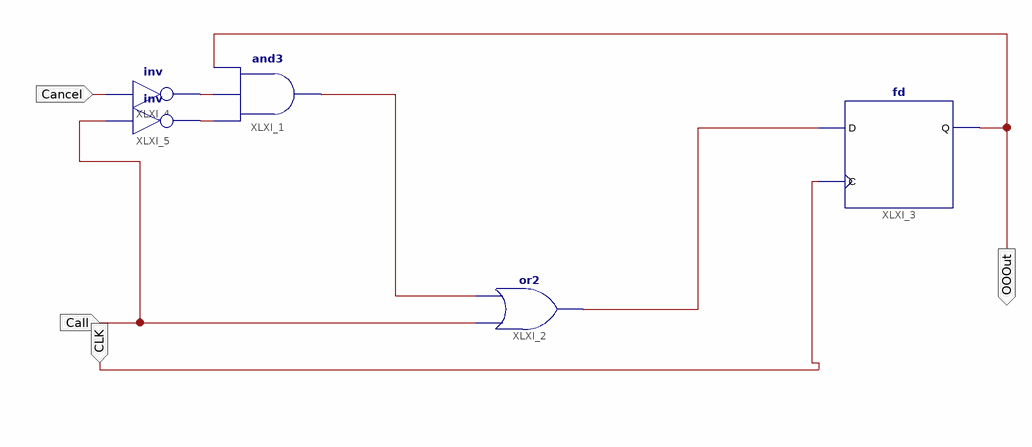
[diagram p0: schematic sheet 1]
// Xilinx ISE schematic Part1A.sch (spartan3e) as structural Verilog: 5 symbols, 4 ports
module Part1A (
  input  Call,
  input  CLK,
  input  Cancel,
  output OOOut
);

  wire XLXN_5, XLXN_6, XLXN_7, XLXN_9;

  and XLXI_1 (XLXN_5, XLXN_7, XLXN_6, OOOut);
  or XLXI_2 (XLXN_9, Call, XLXN_5);
  fd XLXI_3 (.C(CLK), .D(XLXN_9), .Q(OOOut));
  not XLXI_4 (XLXN_6, Cancel);
  not XLXI_5 (XLXN_7, Call);
endmodule
